# Altium project motor_connector.PrjPcb
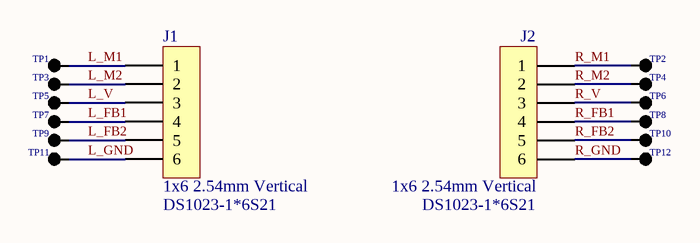
[diagram p0: motor_connector.SchDoc]
1 sheet, 14 parts. Net scope: global (net labels, ports and power ports of the same name join across sheets).
Board file: motor_connector.PcbDoc

## Sheet motor_connector.SchDoc
size A4

### Parts
J1  value DS1023-1*6S21  SCH_Footprint: 1x6 2.54mm Vertical  [J_HEADER_1x6_2.54_VERTICAL]  (hidden comment: Goldpin female straight)
J2  value DS1023-1*6S21  SCH_Footprint: 1x6 2.54mm Vertical  [J_HEADER_1x6_2.54_VERTICAL]  (hidden comment: Goldpin female straight)
TP1  Single pin  [TP_1PIN]  (value not drawn)
TP2  Single pin  [TP_1PIN]  (value not drawn)
TP3  Single pin  [TP_1PIN]  (value not drawn)
TP4  Single pin  [TP_1PIN]  (value not drawn)
TP5  Single pin  [TP_1PIN]  (value not drawn)
TP6  Single pin  [TP_1PIN]  (value not drawn)
TP7  Single pin  [TP_1PIN]  (value not drawn)
TP8  Single pin  [TP_1PIN]  (value not drawn)
TP9  Single pin  [TP_1PIN]  (value not drawn)
TP10  Single pin  [TP_1PIN]  (value not drawn)
TP11  Single pin  [TP_1PIN]  (value not drawn)
TP12  Single pin  [TP_1PIN]  (value not drawn)

### Nets
L_FB1: J1.4 TP7.1(TP)
L_FB2: J1.5 TP9.1(TP)
L_GND: J1.6 TP11.1(TP)
L_M1: J1.1 TP1.1(TP)
L_M2: J1.2 TP3.1(TP)
L_V: J1.3 TP5.1(TP)
R_FB1: J2.4 TP8.1(TP)
R_FB2: J2.5 TP10.1(TP)
R_GND: J2.6 TP12.1(TP)
R_M1: J2.1 TP2.1(TP)
R_M2: J2.2 TP4.1(TP)
R_V: J2.3 TP6.1(TP)

### Library data of the parts
J1 J2 = J_HEADER_1x6_2.54_VERTICAL: Pin Header; Manufacturer: Connfly; Part Number: J_HEADER_1x6_2.54_VERTICAL; HelpURL: https://www.tme.eu/Document/584b1a60cf2e8809a936c5f5ff2de0d5/zl262-sg.pdf; Manufacturer Part Number: DS1023-1*6S21; Supplier 1: TME; Supplier Part Number 1: ZL262-6SG; Supplier 2: RS Components; Supplier 3: Farnell; Supplier 4: Mouser; Supplier 5: Digi-Key; Supplier 6: LCSC
TP1-TP12 = TP_1PIN: Testpoint; SCH_Footprint: Single; Part Number: TP_1PIN; Supplier 1: TME; Supplier 2: RS Components; Supplier 3: Farnell; Supplier 4: Mouser; Supplier 5: Digi-Key; Supplier 6: LCSC